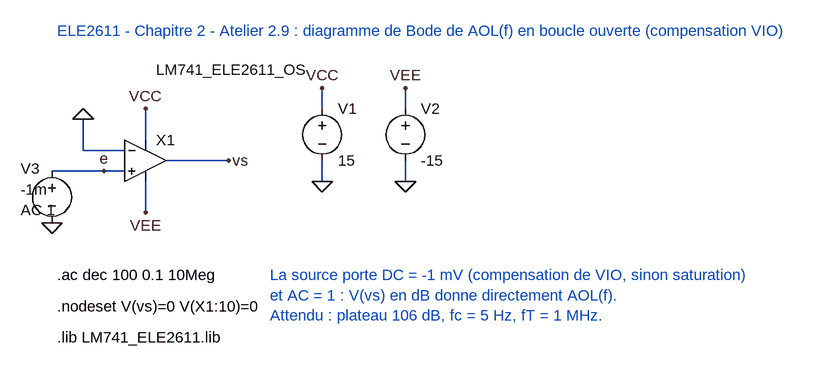
[diagram p0: schematic Ch2_Atelier_2_9_BodeAOL.asc]
Ch2_Atelier_2_9_BodeAOL.asc, the LTspice schematic file:
Version 4
SHEET 1 1200 700
WIRE 64 256 144 256
WIRE 144 256 176 256
WIRE 176 224 112 224
WIRE 112 176 112 224
WIRE 208 160 208 208
WIRE 208 272 208 320
WIRE 240 240 336 240
WIRE 480 128 480 160
WIRE 480 240 480 272
WIRE 608 128 608 160
WIRE 608 240 608 272
FLAG 64 336 0
FLAG 144 256 e
FLAG 112 176 0
FLAG 208 160 VCC
FLAG 208 320 VEE
FLAG 336 240 vs
FLAG 480 128 VCC
FLAG 480 272 0
FLAG 608 128 VEE
FLAG 608 272 0
SYMBOL voltage 64 240 R0
WINDOW 0 -48 12 Left 2
WINDOW 3 -48 44 Left 2
WINDOW 123 -48 76 Left 2
SYMATTR InstName V3
SYMATTR Value -1m
SYMATTR Value2 AC 1
SYMBOL Opamps\\opamp2 208 176 R0
WINDOW 3 16 -76 Left 2
SYMATTR InstName X1
SYMATTR Value LM741_ELE2611_OS
SYMBOL voltage 480 144 R0
SYMATTR InstName V1
SYMATTR Value 15
SYMBOL voltage 608 144 R0
SYMATTR InstName V2
SYMATTR Value -15
TEXT 72 40 Left 2 ;ELE2611 - Chapitre 2 - Atelier 2.9 : diagramme de Bode de AOL(f) en boucle ouverte (compensation VIO)
TEXT 72 416 Left 2 !.ac dec 100 0.1 10Meg
TEXT 72 464 Left 2 !.nodeset V(vs)=0 V(X1:10)=0
TEXT 72 512 Left 2 !.lib LM741_ELE2611.lib
TEXT 400 416 Left 2 ;La source porte DC = -1 mV (compensation de VIO, sinon saturation)\net AC = 1 : V(vs) en dB donne directement AOL(f).\nAttendu : plateau 106 dB, fc = 5 Hz, fT = 1 MHz.

The netlist it stands for:
* Ch2_Atelier_2_9_BodeAOL.asc
V3 e 0 -1m AC 1
XX1 e 0 VCC VEE vs LM741_ELE2611_OS  ; pins In+ In- V+ V- OUT
V1 VCC 0 15
V2 VEE 0 -15
* ELE2611 - Chapitre 2 - Atelier 2.9 : diagramme de Bode de AOL(f) en boucle ouverte (compensation VIO)
.ac dec 100 0.1 10Meg
.nodeset V(vs)=0 V(X1:10)=0
.lib LM741_ELE2611.lib
* La source porte DC = -1 mV (compensation de VIO, sinon saturation)
* et AC = 1 : V(vs) en dB donne directement AOL(f).
* Attendu : plateau 106 dB, fc = 5 Hz, fT = 1 MHz.
.backanno
.end